# Altium schematic sheet Peripherials.SchDoc
size A4; SheetNumber: 2; SheetTotal: 3
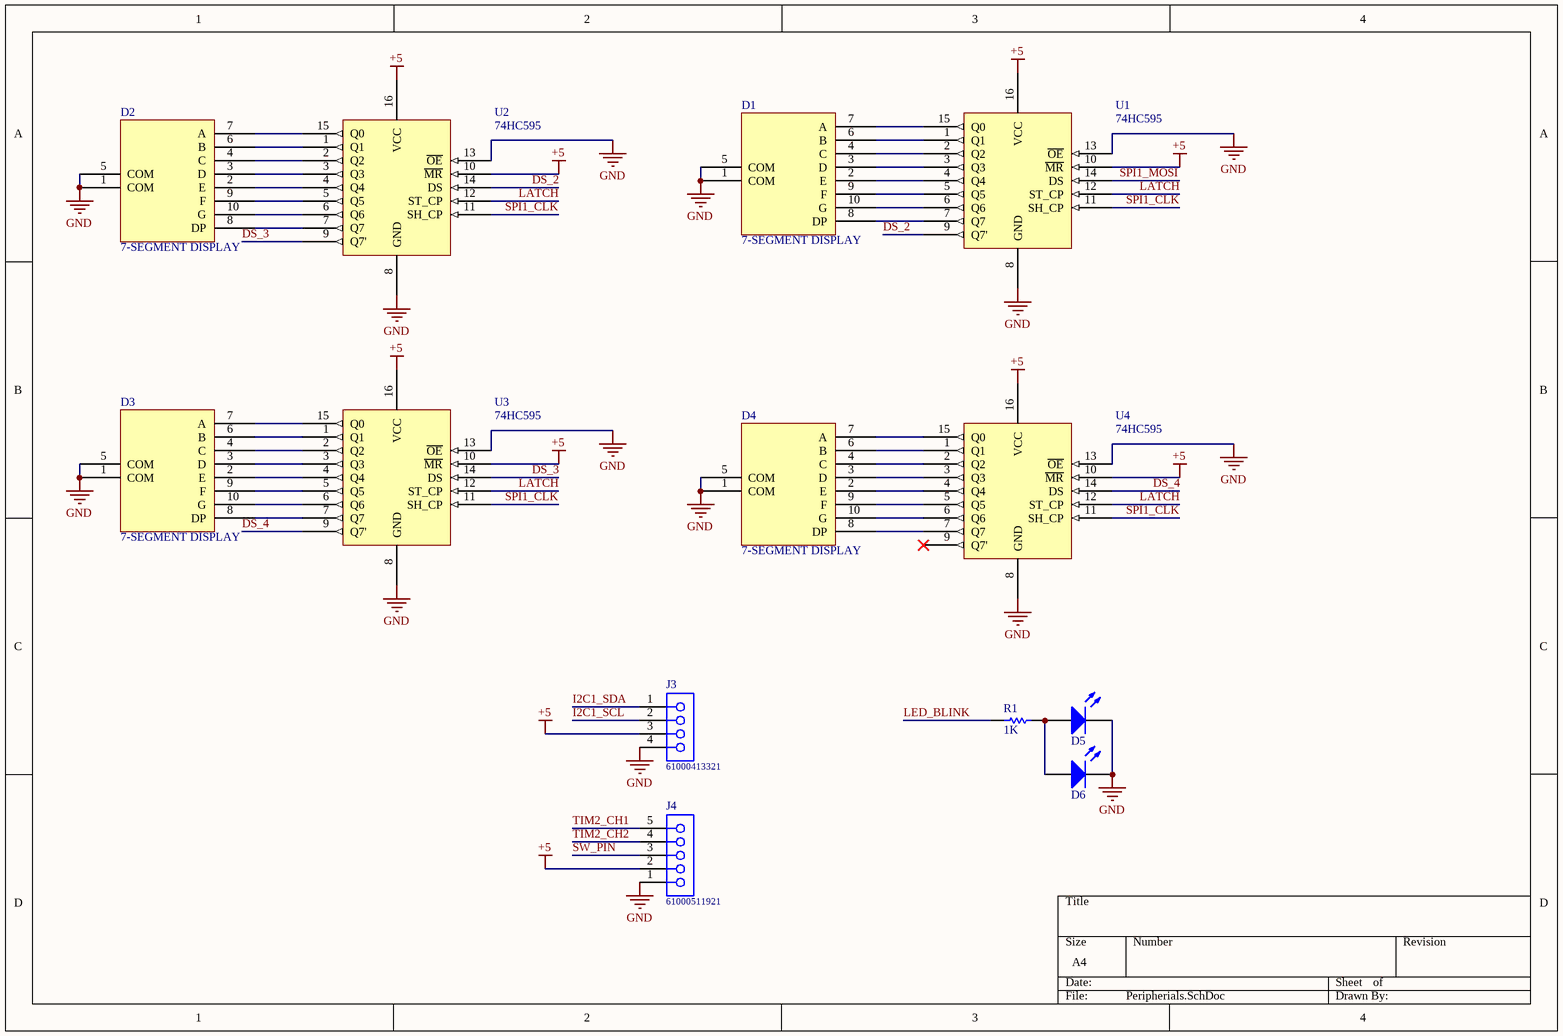
[diagram p0: Peripherials.SchDoc]

## Parts
D1  7-SEGMENT DISPLAY  [7-SEGMENT 1.8INCH]
D2  7-SEGMENT DISPLAY  [7-SEGMENT 1.8INCH]
D3  7-SEGMENT DISPLAY  [7-SEGMENT 1.8INCH]
D4  7-SEGMENT DISPLAY  [7-SEGMENT 1.8INCH]
D5  LED  [LED-3mm]  (value not drawn)
D6  LED  [LED-3mm]  (value not drawn)
J3  61000413321  [61000413321]
J4  61000511921  [61000511921]
R1  value 1K  [RES-SM-0805]  (hidden comment: RESISTOR SMD)
U1  74HC595  [SOIC-16]
U2  74HC595  [SOIC-16]
U3  74HC595  [SOIC-16]
U4  74HC595  [SOIC-16]

## Nets
+5: J3.3 J4.2 U1.10(~{MR}) U1.16(VCC) U2.10(~{MR}) U2.16(VCC) U3.10(~{MR}) U3.16(VCC) U4.10(~{MR}) U4.16(VCC)
GND: D1.1(COM) D1.5(COM) D2.1(COM) D2.5(COM) D3.1(COM) D3.5(COM) D4.1(COM) D4.5(COM) D5.2(K) D6.2(K) J3.4 J4.1 U1.8(GND) U1.13(~{OE}) U2.8(GND) U2.13(~{OE}) U3.8(GND) U3.13(~{OE}) U4.8(GND) U4.13(~{OE})
DS_2: U1.9(Q7') U2.14(DS)
DS_3: U2.9(Q7') U3.14(DS)
DS_4: U3.9(Q7') U4.14(DS)
I2C1_SCL: J3.2
I2C1_SDA: J3.1
LATCH: U1.12(ST_CP) U2.12(ST_CP) U3.12(ST_CP) U4.12(ST_CP)
LED_BLINK: R1.1
SPI1_CLK: U1.11(SH_CP) U2.11(SH_CP) U3.11(SH_CP) U4.11(SH_CP)
SPI1_MOSI: U1.14(DS)
SW_PIN: J4.3
TIM2_CH1: J4.5
TIM2_CH2: J4.4
NetD1_2: D1.2(E) U1.4(Q4)
NetD1_3: D1.3(D) U1.3(Q3)
NetD1_4: D1.4(C) U1.2(Q2)
NetD1_6: D1.6(B) U1.1(Q1)
NetD1_7: D1.7(A) U1.15(Q0)
NetD1_8: D1.8(DP) U1.7(Q7)
NetD1_9: D1.9(F) U1.5(Q5)
NetD1_10: D1.10(G) U1.6(Q6)
NetD2_2: D2.2(E) U2.4(Q4)
NetD2_3: D2.3(D) U2.3(Q3)
NetD2_4: D2.4(C) U2.2(Q2)
NetD2_6: D2.6(B) U2.1(Q1)
NetD2_7: D2.7(A) U2.15(Q0)
NetD2_8: D2.8(DP) U2.7(Q7)
NetD2_9: D2.9(F) U2.5(Q5)
NetD2_10: D2.10(G) U2.6(Q6)
NetD3_2: D3.2(E) U3.4(Q4)
NetD3_3: D3.3(D) U3.3(Q3)
NetD3_4: D3.4(C) U3.2(Q2)
NetD3_6: D3.6(B) U3.1(Q1)
NetD3_7: D3.7(A) U3.15(Q0)
NetD3_8: D3.8(DP) U3.7(Q7)
NetD3_9: D3.9(F) U3.5(Q5)
NetD3_10: D3.10(G) U3.6(Q6)
NetD4_2: D4.2(E) U4.4(Q4)
NetD4_3: D4.3(D) U4.3(Q3)
NetD4_4: D4.4(C) U4.2(Q2)
NetD4_6: D4.6(B) U4.1(Q1)
NetD4_7: D4.7(A) U4.15(Q0)
NetD4_8: D4.8(DP) U4.7(Q7)
NetD4_9: D4.9(F) U4.5(Q5)
NetD4_10: D4.10(G) U4.6(Q6)
NetD5_1: D5.1(A) D6.1(A) R1.2

Not connected (* = marked no-connect by the designer): U4 9(Q7')*

## Library data of the parts
D1-D4 = 7-SEGMENT
J3 = 61000413321: WR-PHD Socket Header, SMT, pitch 2.54mm, Single Row, Vertical, 4p; Manufacturer: Wurth Elektronik; Pin Number: 4; Rated Current: 3A; Working Voltage: 250VAC; Withstanding Voltage: 500VAC; Contact Resistance: 20mOhm; ComponentLink1Description: Manufacturer; ComponentLink1URL: http://www.we-online.de; ComponentLink2Description: Datasheet; ComponentLink2URL: https://www.we-online.com/catalog/datasheet/61000413321.pdf; Manufacturer Part Number: 61000413321; Published Date: May 2020; Pitch: 2.54mm; Operating Temperature: -40 to +125degC; Mounting Technology: SMT; Packaging: Tube; Gender: Socket Header; Row Number: Single; Orientation: Vertical
J4 = 61000511921: WR-PHD Socket Header, SMT, pitch 2.54mm, Single Row, Vertical, 5p; Manufacturer: Wurth Elektronik; Pin Number: 5; Rated Current: 3A; Working Voltage: 250VAC; Withstanding Voltage: 500VAC; Contact Resistance: 20mOhm; ComponentLink1Description: Manufacturer; ComponentLink1URL: http://www.we-online.de; ComponentLink2Description: Datasheet; ComponentLink2URL: https://www.we-online.com/catalog/datasheet/61000511921.pdf; Manufacturer Part Number: 61000511921; Published Date: May 2020; Pitch: 2.54mm; Operating Temperature: -40 to +125degC; Mounting Technology: SMT; Packaging: Tube; Gender: Socket Header; Row Number: Single; Orientation: Vertical
R1 = RESISTOR SMD: Resistor
U1-U4 = 74HC595: 8-Bit Serial-Input/Serial orParallel-Output ShiftRegister with Latched3-State Outputs